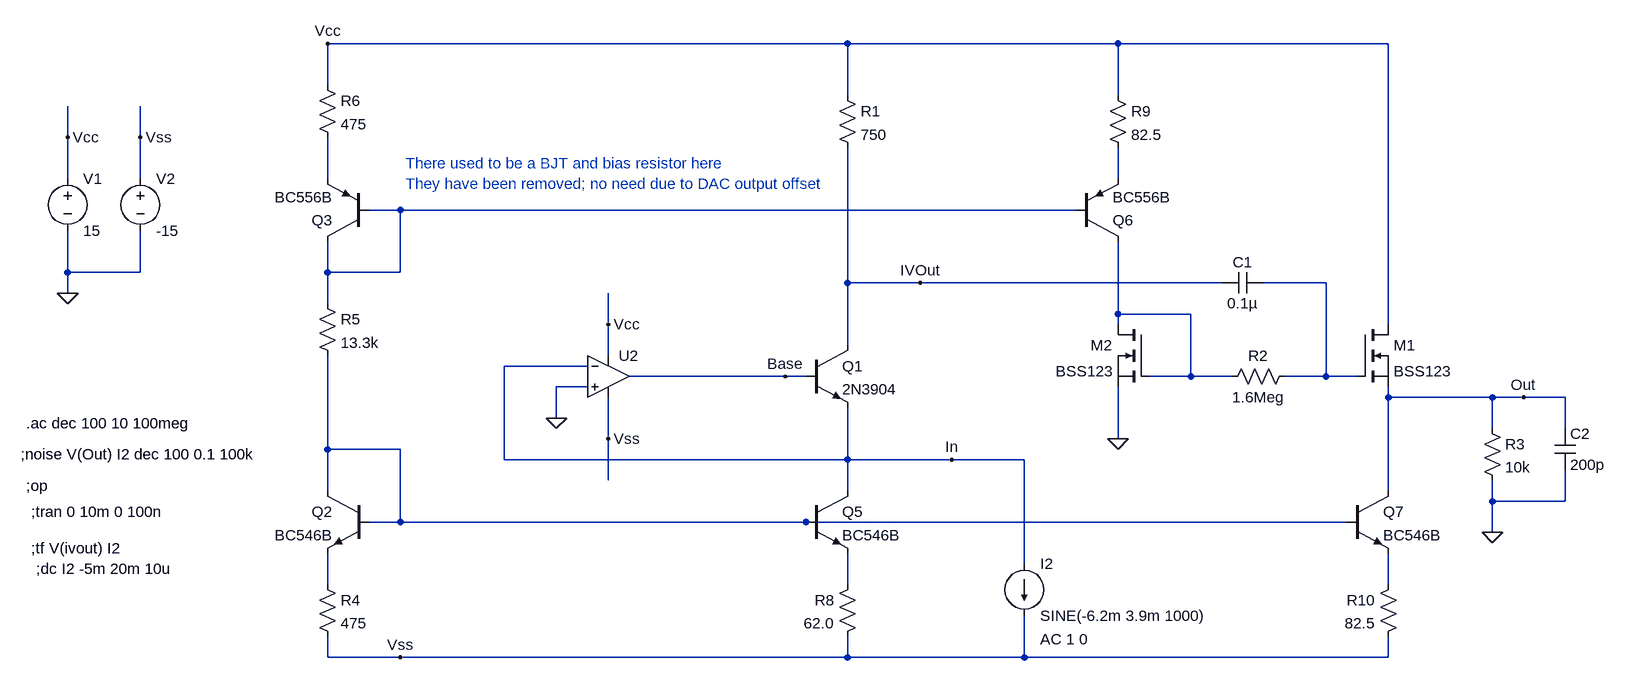
[diagram p0: schematic iv1.asc]
iv1.asc, the LTspice schematic file:
Version 4
SHEET 1 1864 1352
WIRE 688 -432 -112 -432
WIRE 1104 -432 688 -432
WIRE 1520 -432 1104 -432
WIRE -112 -368 -112 -432
WIRE 688 -352 688 -432
WIRE 1104 -352 1104 -432
WIRE -512 -288 -512 -336
WIRE -400 -288 -400 -336
WIRE -512 -224 -512 -288
WIRE -400 -224 -400 -288
WIRE -112 -224 -112 -288
WIRE 1104 -224 1104 -272
WIRE 0 -176 -48 -176
WIRE 1040 -176 0 -176
WIRE -512 -80 -512 -144
WIRE -400 -80 -400 -144
WIRE -400 -80 -512 -80
WIRE -112 -80 -112 -128
WIRE 0 -80 0 -176
WIRE 0 -80 -112 -80
WIRE 688 -64 688 -272
WIRE 800 -64 688 -64
WIRE 1264 -64 800 -64
WIRE 1424 -64 1328 -64
WIRE -512 -48 -512 -80
WIRE -112 -32 -112 -80
WIRE 1104 -16 1104 -128
WIRE 1216 -16 1104 -16
WIRE 320 0 320 -48
WIRE 1104 0 1104 -16
WIRE 1520 0 1520 -432
WIRE 688 32 688 -64
WIRE 320 48 320 0
WIRE 288 64 160 64
WIRE 592 80 352 80
WIRE 624 80 592 80
WIRE 1216 80 1216 -16
WIRE 1216 80 1152 80
WIRE 1280 80 1216 80
WIRE 1424 80 1424 -64
WIRE 1424 80 1360 80
WIRE 1472 80 1424 80
WIRE 288 96 240 96
WIRE 1520 112 1520 96
WIRE 1680 112 1520 112
WIRE 1728 112 1680 112
WIRE 1792 112 1728 112
WIRE 240 144 240 96
WIRE 1680 160 1680 112
WIRE 1792 160 1792 112
WIRE 320 176 320 112
WIRE 1104 176 1104 96
WIRE -112 192 -112 48
WIRE 0 192 -112 192
WIRE 160 208 160 64
WIRE 688 208 688 128
WIRE 688 208 160 208
WIRE 848 208 688 208
WIRE 960 208 848 208
WIRE 320 240 320 176
WIRE -112 256 -112 192
WIRE 688 256 688 208
WIRE 1520 256 1520 112
WIRE 1680 272 1680 240
WIRE 1792 272 1792 224
WIRE 1792 272 1680 272
WIRE 0 304 0 192
WIRE 0 304 -48 304
WIRE 624 304 0 304
WIRE 1456 304 624 304
WIRE 1680 320 1680 272
WIRE 960 368 960 208
WIRE -112 400 -112 352
WIRE 688 400 688 352
WIRE 1520 400 1520 352
WIRE -112 512 -112 480
WIRE 0 512 -112 512
WIRE 688 512 688 480
WIRE 688 512 0 512
WIRE 960 512 960 448
WIRE 960 512 688 512
WIRE 1520 512 1520 480
WIRE 1520 512 960 512
FLAG -512 -48 0
FLAG -512 -288 Vcc
FLAG -400 -288 Vss
FLAG 800 -64 IVOut
FLAG 848 208 In
FLAG 240 144 0
FLAG 320 176 Vss
FLAG 320 0 Vcc
FLAG -112 -432 Vcc
FLAG 592 80 Base
FLAG 1680 320 0
FLAG 1728 112 Out
FLAG 1104 176 0
FLAG 0 512 Vss
SYMBOL voltage -512 -240 R0
WINDOW 123 0 0 Left 2
WINDOW 39 0 0 Left 2
SYMATTR InstName V1
SYMATTR Value 15
SYMBOL voltage -400 -240 R0
WINDOW 123 0 0 Left 2
WINDOW 39 0 0 Left 2
SYMATTR InstName V2
SYMATTR Value -15
SYMBOL npn 624 32 R0
SYMATTR InstName Q1
SYMATTR Value 2N3904
SYMBOL current 960 368 R0
WINDOW 123 24 116 Left 2
WINDOW 39 0 0 Left 2
SYMATTR Value2 AC 1 0
SYMATTR InstName I2
SYMATTR Value SINE(-6.2m 3.9m 1000)
SYMBOL res 672 -368 R0
SYMATTR InstName R1
SYMATTR Value 750
SYMBOL nmos 1472 0 R0
SYMATTR InstName M1
SYMATTR Value BSS123
SYMBOL nmos 1152 0 M0
SYMATTR InstName M2
SYMATTR Value BSS123
SYMBOL res 1376 64 R90
WINDOW 0 0 56 VBottom 2
WINDOW 3 32 56 VTop 2
SYMATTR InstName R2
SYMATTR Value 1.6Meg
SYMBOL cap 1328 -80 R90
WINDOW 0 0 32 VBottom 2
WINDOW 3 32 32 VTop 2
SYMATTR InstName C1
SYMATTR Value 0.1µ
SYMBOL res 1664 144 R0
SYMATTR InstName R3
SYMATTR Value 10k
SYMBOL cap 1776 160 R0
SYMATTR InstName C2
SYMATTR Value 200p
SYMBOL npn -48 256 M0
SYMATTR InstName Q2
SYMATTR Value BC546B
SYMBOL res -128 384 R0
SYMATTR InstName R4
SYMATTR Value 475
SYMBOL res -128 -48 R0
SYMATTR InstName R5
SYMATTR Value 13.3k
SYMBOL pnp -48 -128 R180
SYMATTR InstName Q3
SYMATTR Value BC556B
SYMBOL res -128 -384 R0
SYMATTR InstName R6
SYMATTR Value 475
SYMBOL npn 624 256 R0
SYMATTR InstName Q5
SYMATTR Value BC546B
SYMBOL res 704 384 M0
SYMATTR InstName R8
SYMATTR Value 62.0
SYMBOL res 1088 -368 R0
SYMATTR InstName R9
SYMATTR Value 82.5
SYMBOL pnp 1040 -128 M180
SYMATTR InstName Q6
SYMATTR Value BC556B
SYMBOL npn 1456 256 R0
SYMATTR InstName Q7
SYMATTR Value BC546B
SYMBOL res 1536 384 M0
SYMATTR InstName R10
SYMATTR Value 82.5
SYMBOL Opamps\\UniversalOpamp2 320 80 R0
SYMATTR InstName U2
TEXT -568 288 Left 2 !;tran 0 10m 0 100n
TEXT -576 248 Left 2 !;op
TEXT -584 200 Left 2 !;noise V(Out) I2 dec 100 0.1 100k
TEXT -576 152 Left 2 !.ac dec 100 10 100meg
TEXT -568 344 Left 2 !;tf V(ivout) I2
TEXT -560 376 Left 2 !;dc I2 -5m 20m 10u
TEXT 8 -248 Left 2 ;There used to be a BJT and bias resistor here\nThey have been removed; no need due to DAC output offset

The netlist it stands for:
* iv1.asc
V1 Vcc 0 15
V2 Vss 0 -15
Q1 IVOut Base In 0 2N3904
I2 In Vss SINE(-6.2m 3.9m 1000) AC 1 0
R1 Vcc IVOut 750
M1 Vcc N004 Out Out BSS123
M2 N005 N005 0 0 BSS123
R2 N004 N005 1.6Meg
C1 N004 IVOut 0.1µ
R3 Out 0 10k
C2 Out 0 200p
Q2 N006 N006 N007 0 BC546B
R4 N007 Vss 475
R5 N003 N006 13.3k
Q3 N003 N003 N001 0 BC556B
R6 Vcc N001 475
Q5 In N006 N008 0 BC546B
R8 N008 Vss 62.0
R9 Vcc N002 82.5
Q6 N005 N003 N002 0 BC556B
Q7 Out N006 N009 0 BC546B
R10 N009 Vss 82.5
XU2 0 In Vcc Vss Base level.2 Avol=1Meg GBW=10Meg Slew=10Meg ilimit=25m rail=0 Vos=0 phimargin=45 en=0 enk=0 in=0 ink=0 Rin=500Meg  ; pins IN+ IN- V+ V- OUT
.model NPN NPN
.model PNP PNP
.lib standard.bjt
.model NMOS NMOS
.model PMOS PMOS
.lib standard.mos
;tran 0 10m 0 100n
;op
;noise V(Out) I2 dec 100 0.1 100k
.ac dec 100 10 100meg
;tf V(ivout) I2
;dc I2 -5m 20m 10u
* There used to be a BJT and bias resistor here
* They have been removed; no need due to DAC output offset
.lib UniversalOpamps2.sub
.backanno
.end